# Altium schematic sheet C5444549.SchDoc
size 46 x 32 mm
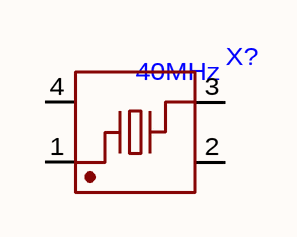
[diagram p0: C5444549.SchDoc]

## Parts
X?  40MHz  [CRYSTAL-SMD_4P-L3.2-W2.5-BL]

## Nets

Not connected (* = marked no-connect by the designer): X? 1 2(GND) 3 4(GND)

## Library data of the parts
X? = XL2EL89CPI-111YLC-40M